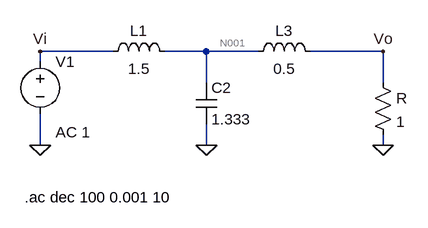
[diagram p0: schematic Circuito.asc]
Circuito.asc, the LTspice schematic file:
Version 4
SHEET 1 880 680
WIRE 304 144 192 144
WIRE 448 144 384 144
WIRE 528 144 448 144
WIRE 720 144 608 144
WIRE 192 160 192 144
WIRE 448 192 448 144
WIRE 720 192 720 144
WIRE 192 288 192 240
WIRE 448 288 448 256
WIRE 720 288 720 272
FLAG 720 288 0
FLAG 448 288 0
FLAG 192 288 0
FLAG 720 144 Vo
FLAG 192 144 Vi
SYMBOL voltage 192 144 R0
WINDOW 123 24 124 Left 2
WINDOW 39 0 0 Left 0
SYMATTR InstName V1
SYMATTR Value ""
SYMATTR Value2 AC 1
SYMBOL ind 288 160 R270
WINDOW 0 32 56 VTop 2
WINDOW 3 5 56 VBottom 2
SYMATTR InstName L1
SYMATTR Value 1.5
SYMBOL ind 512 160 R270
WINDOW 0 32 56 VTop 2
WINDOW 3 5 56 VBottom 2
SYMATTR InstName L3
SYMATTR Value 0.5
SYMBOL cap 432 192 R0
SYMATTR InstName C2
SYMATTR Value 1.333
SYMBOL res 704 176 R0
SYMATTR InstName R
SYMATTR Value 1
TEXT 168 368 Left 2 !.ac dec 100 0.001 10

The netlist it stands for:
* Circuito.asc
V1 Vi 0 AC 1
L1 Vi N001 1.5
L3 N001 Vo 0.5
C2 N001 0 1.333
R Vo 0 1
.ac dec 100 0.001 10
.backanno
.end

* Results of the author's LTspice run, read from the files saved beside the schematic
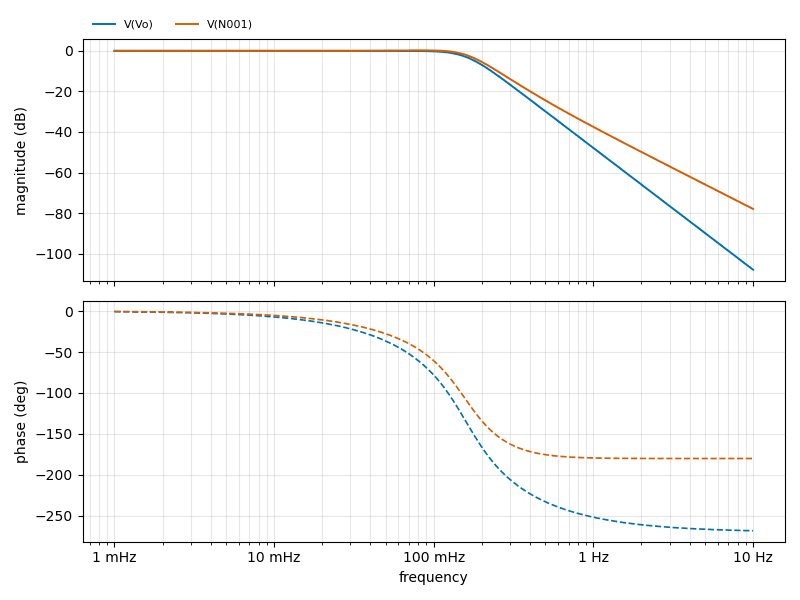
[diagram p1: AC Analysis of Circuito.asc, plotted from the saved traces]
* AC Analysis, 1 run:
*   V(Vo): -0.02 dB at 1 mHz, -107.89 dB at 10 Hz, peak -0.02 dB at 33.88 mHz, 3 dB below the peak at 159.2 mHz
*   V(N001): -0.01 dB at 1 mHz, -77.94 dB at 10 Hz, peak 0.20 dB at 85.11 mHz, 3 dB below the peak at 169.3 mHz